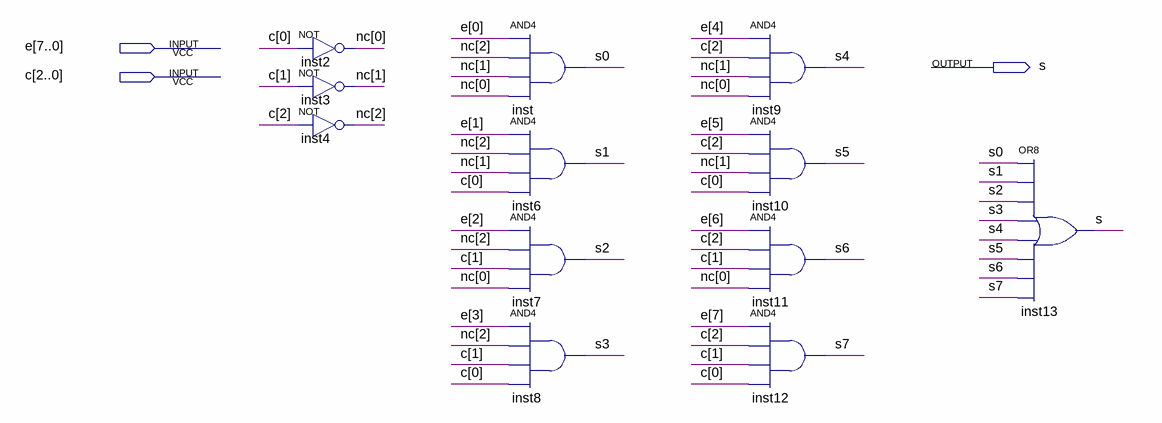
[diagram p0: schematic sheet]
// Quartus schematic jpd_mux_8x1.bdf as structural Verilog: 12 symbols, 3 pins
module jpd_mux_8x1 (
  input  [7:0] e,
  input  [2:0] c,
  output s
);

  wire s0, s1, s2, s3, s4, s5, s6, s7;
  wire [2:0] nc;

  not inst2 (nc[0], c[0]);
  not inst3 (nc[1], c[1]);
  not inst4 (nc[2], c[2]);
  and inst (s0, e[0], nc[2], nc[1], nc[0]);
  and inst6 (s1, e[1], nc[2], nc[1], c[0]);
  and inst7 (s2, e[2], nc[2], c[1], nc[0]);
  and inst8 (s3, e[3], nc[2], c[1], c[0]);
  and inst9 (s4, e[4], c[2], nc[1], nc[0]);
  and inst10 (s5, e[5], c[2], nc[1], c[0]);
  and inst11 (s6, e[6], c[2], c[1], nc[0]);
  and inst12 (s7, e[7], c[2], c[1], c[0]);
  or inst13 (s, s0, s1, s2, s3, s4, s5, s6, s7);
endmodule
